# EAGLE design PCB-SDB-1x4 (EAGLE 7.5.0)
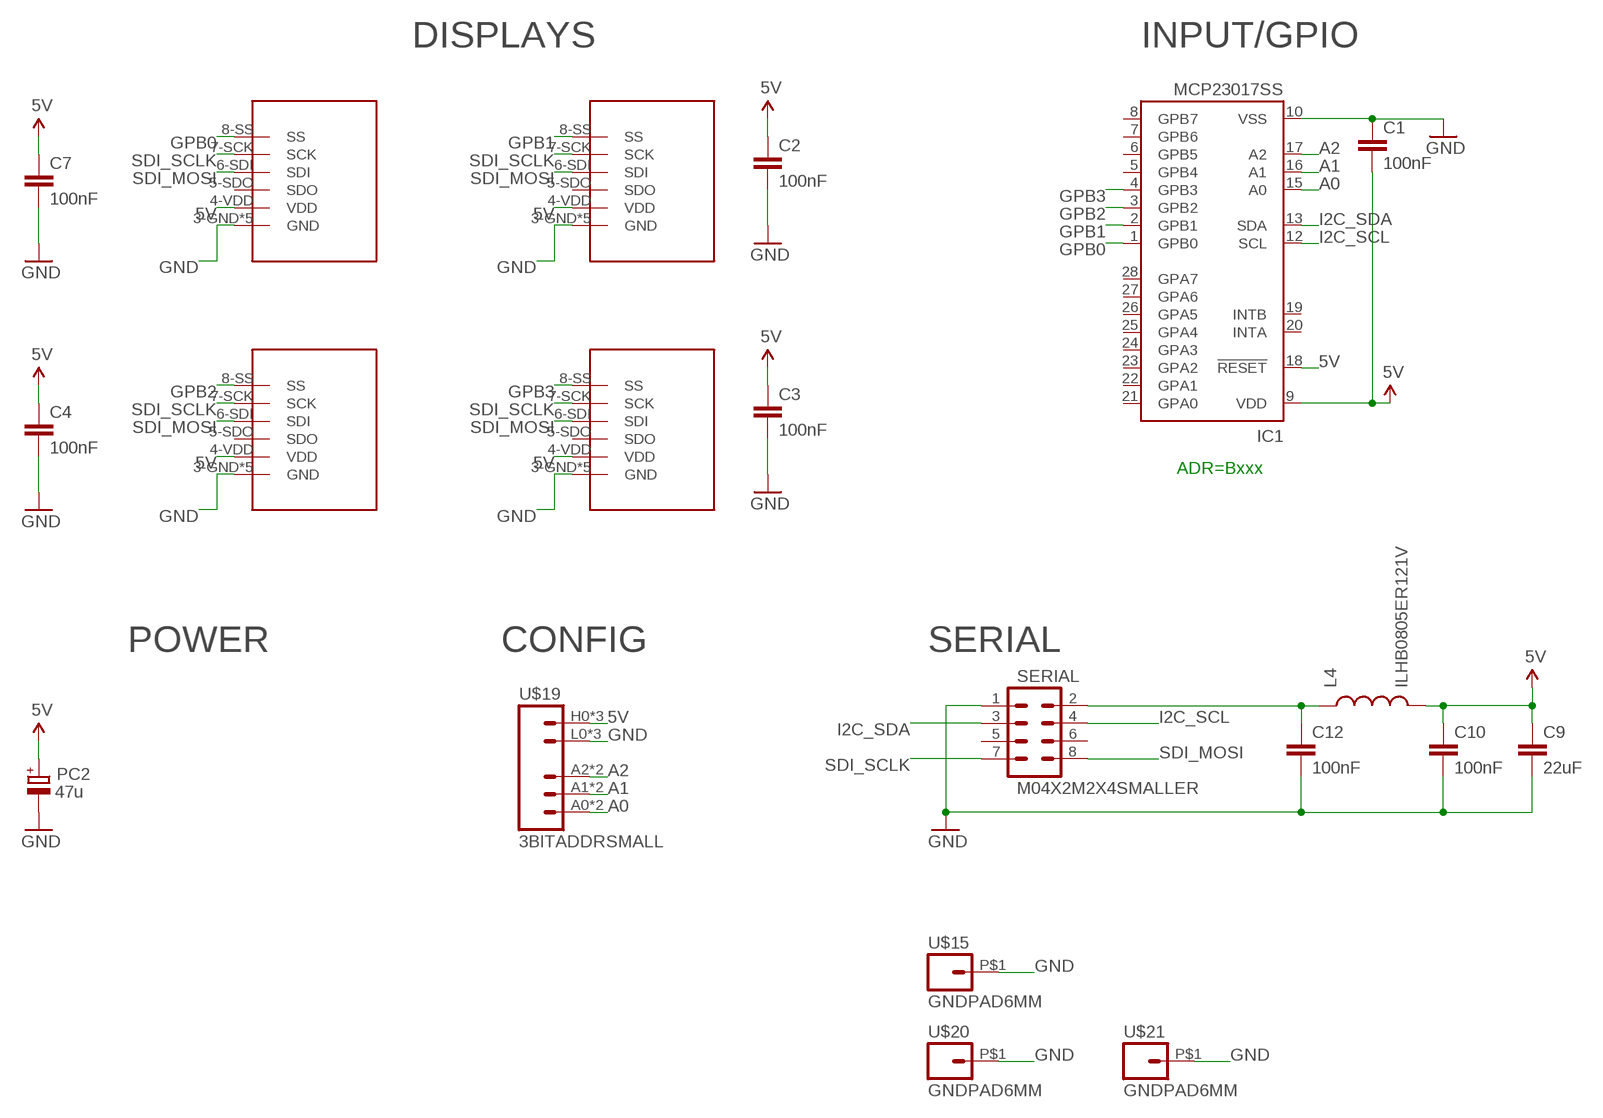
[diagram p0: schematic, sheet 1]

## Parts
C1  100nF  CAP0603-CAP  [0603-CAP]
C2  100nF  CAP0603-CAP  [0603-CAP]
C3  100nF  CAP0603-CAP  [0603-CAP]
C4  100nF  CAP0603-CAP  [0603-CAP]
C7  100nF  CAP0603-CAP  [0603-CAP]
C9  22uF  CAP0805  [0805]
C10  100nF  CAP0603-CAP  [0603-CAP]
C12  100nF  CAP0603-CAP  [0603-CAP]
IC1  MCP23017SS  [SSOP28]
L4  ILHB0805ER121V  INDUCTOR0805  [0805]
PC2  47u  CPOL-EUD  [PANASONIC_D]
SERIAL  M04X2M2X4SMALLER  [M2X4SMALLER]
SSW1  SMART_DISPLAY  [SMART_DISPLAY]
SSW2  SMART_DISPLAY  [SMART_DISPLAY]
SSW3  SMART_DISPLAY  [SMART_DISPLAY]
SSW4  SMART_DISPLAY  [SMART_DISPLAY]
U$15  GNDPAD6MM  [3.2MMPAD6MM]
U$19  3BITADDRSMALL  [3BITADDR_SMALL]
U$20  GNDPAD6MM  [3.2MMPAD6MM]
U$21  GNDPAD6MM  [3.2MMPAD6MM]

## Nets
5V [Power]: C1.2 C2.1 C3.1 C4.1 C7.1 C9.1 C10.1 IC1.9(VDD) IC1.18(!RESET) L4.2 PC2.+ SSW1.4-VDD(VDD) SSW2.4-VDD(VDD) SSW3.4-VDD(VDD) SSW4.4-VDD(VDD) U$19.H0(VCC) U$19.H1(VCC) U$19.H2(VCC)
A0: IC1.15(A0) U$19.A0 U$19.AS0(A0)
A1: IC1.16(A1) U$19.A1 U$19.AS1(A1)
A2: IC1.17(A2) U$19.A2 U$19.AS2(A2)
ARD_5V [Power]: C12.1 L4.1 SERIAL.2
GND [Power]: C1.1 C2.2 C3.2 C4.2 C7.2 C9.2 C10.2 C12.2 IC1.10(VSS) PC2.- SERIAL.1 SSW1.3-GND(GND) SSW1.P$1(GND) SSW1.P$2(GND) SSW1.P$3(GND) SSW1.P$4(GND) SSW2.3-GND(GND) SSW2.P$1(GND) SSW2.P$2(GND) SSW2.P$3(GND) SSW2.P$4(GND) SSW3.3-GND(GND) SSW3.P$1(GND) SSW3.P$2(GND) SSW3.P$3(GND) SSW3.P$4(GND) SSW4.3-GND(GND) SSW4.P$1(GND) SSW4.P$2(GND) SSW4.P$3(GND) SSW4.P$4(GND) U$15.P$1 U$19.L0(GND) U$19.L1(GND) U$19.L2(GND) U$20.P$1 U$21.P$1
GPB0: IC1.1(GPB0) SSW1.8-SS(SS)
GPB1: IC1.2(GPB1) SSW2.8-SS(SS)
GPB2: IC1.3(GPB2) SSW3.8-SS(SS)
GPB3: IC1.4(GPB3) SSW4.8-SS(SS)
I2C_SCL: IC1.12(SCL) SERIAL.4
I2C_SDA: IC1.13(SDA) SERIAL.3
SDI_MOSI: SERIAL.8 SSW1.6-SDI(SDI) SSW2.6-SDI(SDI) SSW3.6-SDI(SDI) SSW4.6-SDI(SDI)
SDI_SCLK: SERIAL.7 SSW1.7-SCK(SCK) SSW2.7-SCK(SCK) SSW3.7-SCK(SCK) SSW4.7-SCK(SCK)
Unconnected: IC1.5(GPB4) IC1.6(GPB5) IC1.7(GPB6) IC1.8(GPB7) IC1.19(INTB) IC1.20(INTA) IC1.21(GPA0) IC1.22(GPA1) IC1.23(GPA2) IC1.24(GPA3) IC1.25(GPA4) IC1.26(GPA5) IC1.27(GPA6) IC1.28(GPA7) SERIAL.5 SERIAL.6 SSW1.5-SDO(SDO) SSW2.5-SDO(SDO) SSW3.5-SDO(SDO) SSW4.5-SDO(SDO)

## Notes on the sheet
- DISPLAYS | INPUT/GPIO
- ADR=Bxxx
- POWER | CONFIG | SERIAL

## Library data of the parts
C1-C4 C7 C9 C10 C12 = SparkFun:CAP: Capacitor Standard 0603 ceramic capacitor, and 0.1" leaded capacitor.
IC1 = microchip:MCP23017: http://ww1.microchip.com/downloads/en/DeviceDoc/21952a.pdf Source: http://ww1.microchip.com/downloads/en/DeviceDoc/21952a.pdf; MF: MICROCHIP; MPN: MCP23017-E/SS; OC_FARNELL: 1467674; OC_NEWARK: 31K2960
L4 = SparkFun:INDUCTOR: Inductors Basic Inductor/Choke - 0603 and 1206. Footprints are not proven and vary greatly between part numbers.
PC2 = rcl:CPOL-EU: POLARIZED CAPACITOR, European symbol
SERIAL = SKAARHOJ:M04X2
SSW1-SSW4 = SKAARHOJ:SMART_DISPLAY
U$15 U$20 U$21 = SKAARHOJ:GNDPAD
U$19 = SKAARHOJ:3BITADDR

## Net classes
0 default: width 0.203 mm, drill 0.406 mm, clearance 0.203 mm
1 Power: width 0.406 mm, drill 0.61 mm, clearance 0.203 mm

## Board
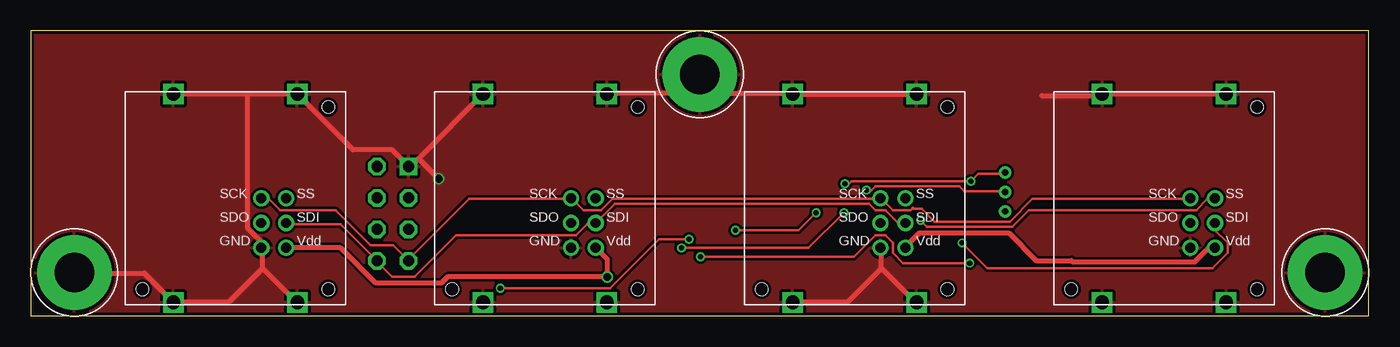
[diagram p1: board, top side]
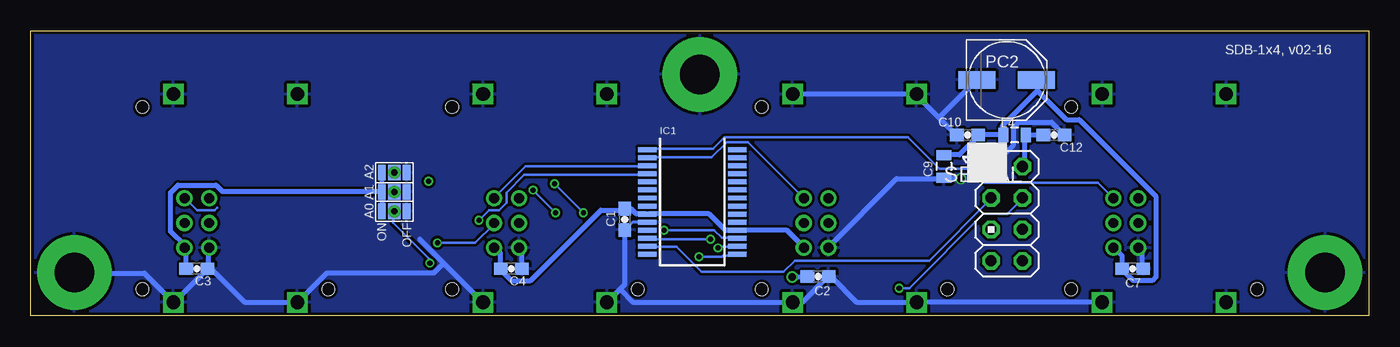
[diagram p2: board, bottom side, seen from below]

Size 108 x 23 mm. Coordinates in mm from the lower left corner, seen from the top.
Outline: 0,0 108,0 108,23 0,23 0,0
Copper layers (1*16): Top 0.035mm / dielectric 1.5mm / Bottom 0.035mm
Design rules "Fusion_eagle_rule_v1.1": minimum track width 6mil, minimum drill 12mil, track to track 6mil, track to pad 6mil, pad to pad 6mil, via to via 6mil, smd to smd 0mil, copper to edge 10mil, drill to drill 10mil, minimum pad ring 10mil, minimum via ring 6mil, stop-mask expansion 2mil, vias tented up to drill 100mil, thermal gap 10mil

### Footprints (pad centres in the part's own frame; a part is rotated, then mirrored left to right if it is on the bottom)
0603-CAP = smd 1.1 x 1: 1 -0.85,0; 2 0.85,0
0805 = smd 0.8 x 1.2: 1 -0.9,0; 2 0.9,0
SSOP28 = smd 0.4 x 1.5: 1 -4.225,-3.625; 2 -3.575,-3.625; 3 -2.925,-3.625; 4 -2.275,-3.625; 5 -1.625,-3.625; 6 -0.975,-3.625; 7 -0.325,-3.625; 8 0.325,-3.625; 9 0.975,-3.625; 10 1.625,-3.625; 11 2.275,-3.625; 12 2.925,-3.625; 13 3.575,-3.625; 14 4.225,-3.625; 15 4.225,3.625; 16 3.575,3.625; 17 2.925,3.625; 18 2.275,3.625; 19 1.625,3.625; 20 0.975,3.625; 21 0.325,3.625; 22 -0.325,3.625; 23 -0.975,3.625; 24 -1.625,3.625; 25 -2.275,3.625; 26 -2.925,3.625; 27 -3.575,3.625; 28 -4.225,3.625
PANASONIC_D = smd 3 x 1.4: + 2.4,0; - -2.4,0
M2X4SMALLER = drill 0.9 square: 1 -1.27,3.81 | drill 0.9 octagon: 2 1.27,3.81; 3 -1.27,1.27; 4 1.27,1.27; 5 -1.27,-1.27; 6 1.27,-1.27; 7 -1.27,-3.81; 8 1.27,-3.81
SMART_DISPLAY = drill 0.8: 3-GND 2.1,-4; 4-VDD 4.1,-4; 5-SDO 2.1,-2; 6-SDI 4.1,-2; 7-SCK 2.1,0; 8-SS 4.1,0 | drill 1.1 square: P$1 -5,8.4; P$2 5,8.4; P$3 5,-8.4; P$4 -5,-8.4 | hole 1: 7.5,7.35; 7.5,-7.35; -7.5,-7.35
3.2MMPAD6MM = drill 3.2 pad 6: P$1 0,0
3BITADDR_SMALL = drill 0.5: A0 -1.565,0; A1 0,0; A2 1.565,0 | smd 1.27 x 1: AS0 -1.565,0; AS1 0,0; AS2 1.565,0 | smd 1.27 x 0.635: H0 -1.565,1; H1 0,1; H2 1.565,1; L0 -1.565,-1; L1 0,-1; L2 1.565,-1

### Placement (x,y rotation side)
C1  60.05,7.8 90 bottom
C2  44.45,3.17 0 bottom
C3  94.61,3.81 0 bottom
C4  69.22,3.81 0 bottom
C7  19.05,3.81 0 bottom
C9  34.29,12.06 270 bottom
C10  32.38,14.61 180 bottom
C12  25.4,14.61 0 bottom
IC1  54.61,9.19 270 bottom
L4  28.57,14.61 180 bottom
PC2  29.21,19.05 0 bottom
SERIAL  29.21,8.26 0 bottom
SSW1  16.5,9.5 0 top
SSW2  41.5,9.5 0 top
SSW3  66.5,9.5 0 top
SSW4  91.5,9.5 0 top
U$15  3.5,3.5 0 top
U$19  78.66,10.01 90 bottom
U$20  54,19.5 0 top
U$21  104.5,3.5 0 top

### Tracks (layer width: path | path; a pad name or v marks a point on that pad's centre or on a via)
5V  (via drill 0.61)
  Top 0.406: SSW2.4-VDD 45.62,5.49 46.53,4.57 v46.53,3.15 33.63,3.15 33.12,2.64 27.84,2.64 24.99,5.49 20.62,5.49 SSW1.4-VDD | SSW3.4-VDD 70.61,5.59 71.73,6.71 78.94,6.71 81.18,4.47 84.02,4.47 84.12,4.37 93.98,4.37 95.1,5.49 95.5,5.49 SSW4.4-VDD
  Bottom 0.406: C9.1 34.24,13.01 33.02,13.01 31.6,14.43 C10.1 31.5,14.63 29.57,14.63 L4.2 29.57,14.83 29.57,15.34 26.72,18.19 | SSW1.4-VDD 20.52,5.49 19.91,4.88 19.91,3.86 C7.1 19.81,3.66 19,2.85 17.48,2.85 17.17,3.15 17.17,9.65 23.37,15.85 24.38,15.85 26.72,18.19 | 26.72,18.19 26.72,19 PC2.+ | v46.53,3.15 45.31,3.15 C2.1 | SSW2.4-VDD 45.62,5.59 46.94,6.91 50.9,6.91 IC1.18 51.1,6.91 51.92,6.91 53.24,8.23 58.12,8.23 IC1.9 58.32,8.23 59.13,8.23 59.54,8.64 60.05,8.64 C1.2 60.15,8.53 61.98,8.53 67.67,2.85 69.19,2.85 70,3.66 C4.1 70.1,3.86 70.1,5.08 70.51,5.49 SSW3.4-VDD | C3.1 95.5,3.86 95.5,5.49 SSW4.4-VDD 95.61,5.69 96.72,6.81 96.72,9.96 96.11,10.57 93.07,10.57 92.56,10.06 79.86,10.06 U$19.H1 | U$19.H0 79.65,8.53 79.65,9.96 U$19.H1 | U$19.H2 79.65,11.48 79.65,10.16 U$19.H1
A0  (via drill 0.41)
  Top 0.203: v54.05,4.78 66.45,4.78 68.17,6.5 68.99,6.5 69.6,5.89 69.6,5.08 70.41,4.27 v75.79,4.27
  Bottom 0.203: v54.05,4.78 52.22,4.78 52.12,4.88 51,4.88 IC1.15 | 78.74,8.43 U$19.AS0 78.74,8.33 78.74,7.52 75.79,4.57 v75.79,4.27
A1  (via drill 0.41)
  Top 0.203: v52.53,5.49 62.79,5.49 v65.63,8.33 | v67.46,10.16 67.87,10.16 68.17,10.46 74.98,10.46 75.39,10.06 78.64,10.06 U$19.AS1
  Bottom 0.203: v52.53,5.49 52.43,5.59 51,5.59 IC1.16 | v67.46,10.16 v65.63,8.33 | 78.74,10.06 U$19.AS1
A2  (via drill 0.41)
  Top 0.203: v56.9,6.91 61.98,6.91 v63.4,8.33 | v65.73,10.67 66.04,10.67 66.24,10.87 v75.89,10.87 76.5,11.48 78.64,11.48 U$19.AS2
  Bottom 0.203: v56.9,6.91 52.83,6.91 52.22,6.3 51,6.3 IC1.17 | v65.73,10.67 v63.4,8.33 | 78.74,11.58 U$19.AS2
ARD_5V
  Bottom 0.406: C12.1 26.31,14.63 27.64,14.63 L4.1 27.74,14.43 27.74,12.29 27.94,12.09 SERIAL.2
GND  (via drill 0.61)
  Top 0.406: 68.68,3.86 68.68,5.49 SSW3.3-GND | 68.68,3.86 71.42,1.12 SSW3.P$3 | 68.68,3.86 65.94,1.12 61.57,1.12 SSW3.P$4 | 18.69,3.86 18.69,5.49 SSW1.3-GND 18.59,5.69 18.59,5.99 17.48,7.11 17.48,17.88 | 18.69,3.86 21.44,1.12 SSW1.P$3 | 18.69,3.86 15.95,1.12 11.58,1.12 SSW1.P$4 11.38,1.22 9.14,3.45 3.56,3.45 U$15.P$1 | SSW4.P$2 96.42,17.88 86.56,17.88 SSW4.P$1 86.36,17.78 81.58,17.78 | 71.53,17.88 SSW3.P$2 71.32,17.88 61.67,17.88 SSW3.P$1 61.47,17.98 55.58,17.98 54.15,19.41 U$20.P$1 53.95,19.41 52.53,17.98 46.53,17.98 SSW2.P$2 | 17.48,17.88 21.44,17.88 SSW1.P$2 21.64,17.78 26.01,13.41 29.16,13.41 30.38,12.19 SERIAL.1 30.48,12.09 30.68,12.09 31.29,12.7 | 17.48,17.88 11.58,17.88 SSW1.P$1 | 31.29,12.7 36.47,17.88 SSW2.P$1 | 31.29,12.7 v32.92,11.07
  Bottom 0.254: IC1.10 59.42,7.57 C1.1
  Bottom 0.406: C3.2 93.67,3.86 93.67,5.49 SSW4.3-GND | C3.2 93.88,3.66 96.42,1.12 SSW4.P$3 96.62,1.22 98.86,3.45 104.44,3.45 U$21.P$1 | C3.2 93.47,3.86 90.73,1.12 86.56,1.12 SSW4.P$4 86.36,1.22 84.12,3.45 75.49,3.45 74.68,4.27 | C1.1 60.05,2.54 60.45,2.13 | 60.45,2.13 61.47,1.12 SSW3.P$4 | C4.2 68.38,3.86 68.38,5.28 68.58,5.49 SSW3.3-GND | 74.68,4.27 71.53,1.12 SSW3.P$3 | 74.68,4.27 76.61,6.2 | 60.45,2.13 59.44,1.12 46.63,1.12 SSW2.P$3 46.43,1.12 45.72,1.12 43.69,3.15 C2.2 43.38,3.15 41.35,1.12 36.58,1.12 SSW2.P$4 36.37,1.12 21.54,1.12 SSW1.P$3 | C7.2 18.29,3.86 18.29,5.18 18.59,5.49 SSW1.3-GND | SSW2.3-GND 43.59,5.59 38.1,11.07 34.34,11.07 C9.2 34.14,11.07 v32.92,11.07 | C12.2 24.59,14.63 25.6,15.65 28.25,15.65 28.65,15.24 28.65,13.82 30.48,11.99 SERIAL.1 | 34.7,16 36.58,17.88 SSW2.P$1 36.78,17.88 46.43,17.88 SSW2.P$2 | 34.7,16 33.33,14.63 C10.2 | 34.7,16 31.7,19 PC2.-
  pour Top: 0,0 107.95,0 107.95,22.86 0,22.86
  pour Bottom: 0,0 107.95,0 107.95,22.86 0,22.86
GPB0
  Bottom 0.203: 32.11,11.89 32.21,11.89 | 32.21,11.89 34.65,11.89 37.19,14.43 52.02,14.43 52.93,13.51 58.22,13.51 IC1.1 | SSW1.8-SS 20.62,9.55 21.84,10.77 30.99,10.77 31.19,10.97 31.29,10.97 32.21,11.89
GPB1
  Bottom 0.203: IC1.2 58.22,12.8 53.03,12.8 51.82,14.02 50.09,14.02 45.62,9.55 SSW2.8-SS
GPB2
  Bottom 0.203: IC1.3 58.32,12.09 68.07,12.09 70.61,9.55 SSW3.8-SS
GPB3  (via drill 0.41)
  Top 0.203: v71.83,7.72 72.34,7.21 79.25,7.21 80.57,8.53 94.08,8.53 95,9.45 95.5,9.45 SSW4.8-SS
  Bottom 0.203: 92.96,8.74 93.17,8.53 94.59,8.53 95.5,9.45 SSW4.8-SS | IC1.4 58.32,11.38 68.17,11.38 69.6,9.96 69.6,9.14 70.21,8.53 71.02,8.53 v71.83,7.72
I2C_SCL  (via drill 0.41)
  Top 0.203: v53.14,6.2 50.7,6.2 46.74,2.23 v37.9,2.23
  Bottom 0.203: v53.14,6.2 58.22,6.2 IC1.12 | v37.9,2.23 37.08,2.23 31.09,8.23 29.16,8.23 27.94,9.45 SERIAL.4
I2C_SDA
  Bottom 0.203: IC1.13 58.22,5.59 55.88,5.59 53.85,3.56 47.24,3.56 46.33,4.47 35.46,4.47 30.48,9.45 SERIAL.3
SDI_MOSI  (via drill 0.41)
  Top 0.203: SSW1.6-SDI 20.62,7.42 24.99,7.42 27.94,4.47 SERIAL.8 27.94,4.37 29.16,3.15 30.99,3.15 34.34,6.5 43.99,6.5 44.91,7.42 45.52,7.42 SSW2.6-SDI 47.14,9.04 67.67,9.04 68.17,8.53 68.99,8.53 70,7.52 70.51,7.52 SSW3.6-SDI | v75.18,5.89 77.22,3.86 95.4,3.86 96.62,5.08 96.62,5.89 95.61,6.91 95.61,7.42 SSW4.6-SDI
  Bottom 0.203: v75.18,5.89 72.14,5.89 70.61,7.42 SSW3.6-SDI
SDI_SCLK
  Top 0.203: SSW1.7-SCK 18.69,9.45 19.2,9.45 20.12,8.53 24.59,8.53 27.43,5.69 29.26,5.69 30.48,4.47 SERIAL.7 30.48,4.57 35.36,9.45 43.59,9.45 SSW2.7-SCK 43.69,9.45 44.6,8.53 46.02,8.53 46.94,9.45 68.58,9.45 SSW3.7-SCK 68.68,9.45 69.6,8.53 71.02,8.53 71.17,8.69 | 71.17,8.69 71.22,8.74 | 93.57,9.45 SSW4.7-SCK 93.47,9.45 80.87,9.45 79.05,7.62 72.95,7.62 71.93,8.64 71.22,8.64 71.17,8.69

### Text on the board
_bsilk: SDB-1x4, v02-16 | 1